# Altium schematic sheet Power.SchDoc
size A
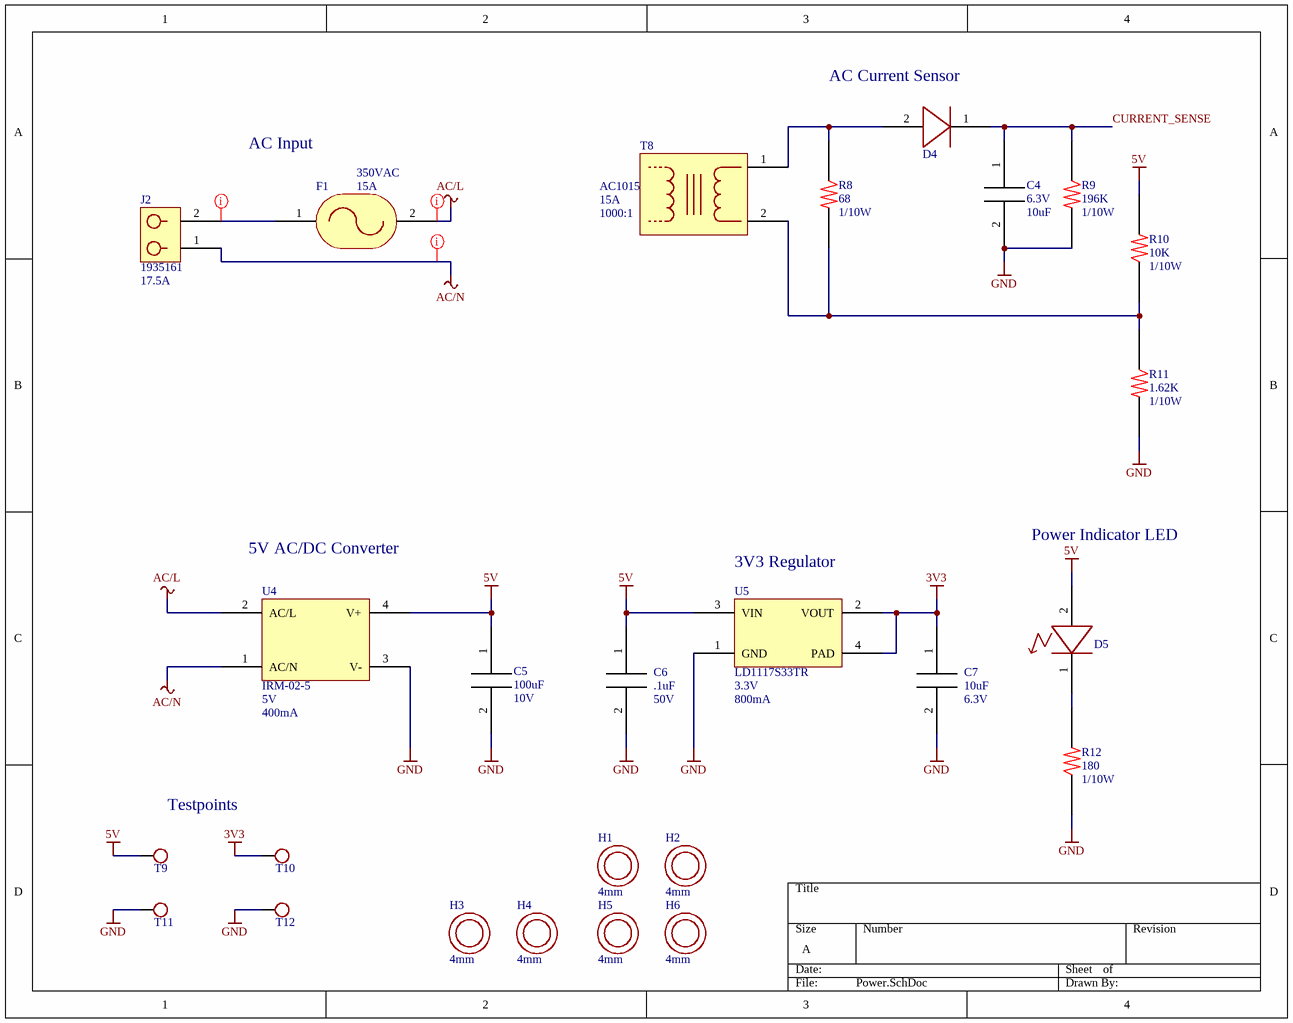
[diagram p0: Power.SchDoc]

## Parts
C4  value 10uF  Rating: 6.3V  [0603]  (hidden comment: C_CAP_0603)
C5  value 100uF  Rating: 10V  [1210]  (hidden comment: C_CAP_1210)
C6  value .1uF  Rating: 50V  [0603]  (hidden comment: C_CAP_0603)
C7  value 10uF  Rating: 6.3V  [0603]  (hidden comment: C_CAP_0603)
D4  D_DIODE_SOD123  [SOD123]  (value not drawn)
D5  D_LED_LED5MM  [LED5MM]  (value not drawn)
F1  value 15A  Rating: 350VAC  [2410]  (hidden comment: F_FUSE_2410)
H1  value 4mm  [MOUNTHOLE4MM]  (hidden comment: H_MOUNTHOLE_MOUNTHOLE4MM)
H2  value 4mm  [MOUNTHOLE4MM]  (hidden comment: H_MOUNTHOLE_MOUNTHOLE4MM)
H3  value 4mm  [MOUNTHOLE4MM]  (hidden comment: H_MOUNTHOLE_MOUNTHOLE4MM)
H4  value 4mm  [MOUNTHOLE4MM]  (hidden comment: H_MOUNTHOLE_MOUNTHOLE4MM)
H5  value 4mm  [MOUNTHOLE4MM]  (hidden comment: H_MOUNTHOLE_MOUNTHOLE4MM)
H6  value 4mm  [MOUNTHOLE4MM]  (hidden comment: H_MOUNTHOLE_MOUNTHOLE4MM)
J2  Rating: 17.5A  [1935161]  (hidden comment: J_2POSTERM_1935161)
R8  value 68  Rating: 1/10W  [0603]  (hidden comment: R_RES_0603)
R9  value 196K  Rating: 1/10W  [0603]  (hidden comment: R_RES_0603)
R10  value 10K  Rating: 1/10W  [0603]  (hidden comment: R_RES_0603)
R11  value 1.62K  Rating: 1/10W  [0603]  (hidden comment: R_RES_0603)
R12  value 180  Rating: 1/10W  [0603]  (hidden comment: R_RES_0603)
T8  value 1000:1  Rating: 15A  [AC1015]  (hidden comment: T_CURRTRANS_AC1015)
T9  TESTPOINT  [TESTPOINT1MM]  (value not drawn)
T10  TESTPOINT  [TESTPOINT1MM]  (value not drawn)
T11  TESTPOINT  [TESTPOINT1MM]  (value not drawn)
T12  TESTPOINT  [TESTPOINT1MM]  (value not drawn)
U4  value 5V  Rating: 400mA  [IRM-02-5]  (hidden comment: U_IRM-02-5_IRM-02-5)
U5  value 3.3V  Rating: 800mA  PartNumber: LD1117S33TR  [SOT223]  (hidden comment: U_LD1117S33TR_SOT223)

## Nets
3V3: C7.1 T10.1 U5.2(VOUT) U5.4(PAD)
5V: C5.1 C6.1 D5.2 R10.2 T9.1 U4.4(V+) U5.3(VIN)
AC/L: F1.2 U4.2(AC/L)
AC/N: J2.1 U4.1(AC/N)
GND: C4.2 C5.2 C6.2 C7.2 R9.2 R11.2 R12.1 T11.1 T12.1 U4.3(V-) U5.1(GND)
CURRENT_SENSE: C4.1 D4.1 R9.1
NetD4_2: D4.2 R8.1 T8.1
NetD5_1: D5.1 R12.2
NetF1_1: F1.1 J2.2
NetR8_2: R8.2 R10.1 R11.1 T8.2

## Layout directives
rule Width Constraint [Pref Width = 100mil    Min Width = 15mil    Max Width = 250mil]; rule Clearance Constraint [Generic clearance = 45mil, and 18 value(s) for objects]: AC/L, AC/N, NetF1_1

## Notes on the sheet
- (near D4) AC Current Sensor
- AC Input
- 5V AC/DC Converter
- (near U5) 3V3 Regulator
- Power Indicator LED
- Testpoints

## Library data of the parts
C4 C7 = C_CAP_0603: PartNumber: JMK107ABJ106MA-T; Manufacturer: Taiyo Yuden
C5 = C_CAP_1210: PartNumber: GRM32ER61A107ME20L; Manufacturer: Murata
C6 = C_CAP_0603: PartNumber: C0603C104K5RACAUTO; Manufacturer: KEMET
D4 = D_DIODE_SOD123: PartNumber: BAS16GWJ; Manufacturer: Nexperia USA Inc; Rating: 215mA
F1 = F_FUSE_2410: PartNumber: 0679H9150-05; Manufacturer: Bel Fuse
J2 = J_2POSTERM_1935161: Manufacturer: Phoenix Contact; PartNumber: 1935161
R8 = R_RES_0603: PartNumber: RC0603FR-0768RL; Manufacturer: Yageo
R9 = R_RES_0603: PartNumber: RC0603FR-07196KL; Manufacturer: Yageo
R10 = R_RES_0603: PartNumber: RC0603JR-0710KL; Manufacturer: Yageo
R11 = R_RES_0603: PartNumber: RC0603FR-071K62L; Manufacturer: Yageo
R12 = R_RES_0603: PartNumber: RC0603JR-07180RL; Manufacturer: Yageo
T8 = T_CURRTRANS_AC1015: Manufacturer: Acme Electric/Amveco/Actown; PartNumber: AC1015
T9-T12 = T_TESTPOINT_TESTPOINT1MM: Value: 1mm
U5 = U_LD1117S33TR_SOT223: Manufacturer: STM
H1-H6 = H_MOUNTHOLE_MOUNTHOLE4MM: PartNumber: *
U4 = U_IRM-02-5_IRM-02-5: PartNumber: IRM-02-5